# Altium schematic sheet JETSON_PWR_MUX.SchDoc
size B; SheetNumber: 18; SheetTotal: 19
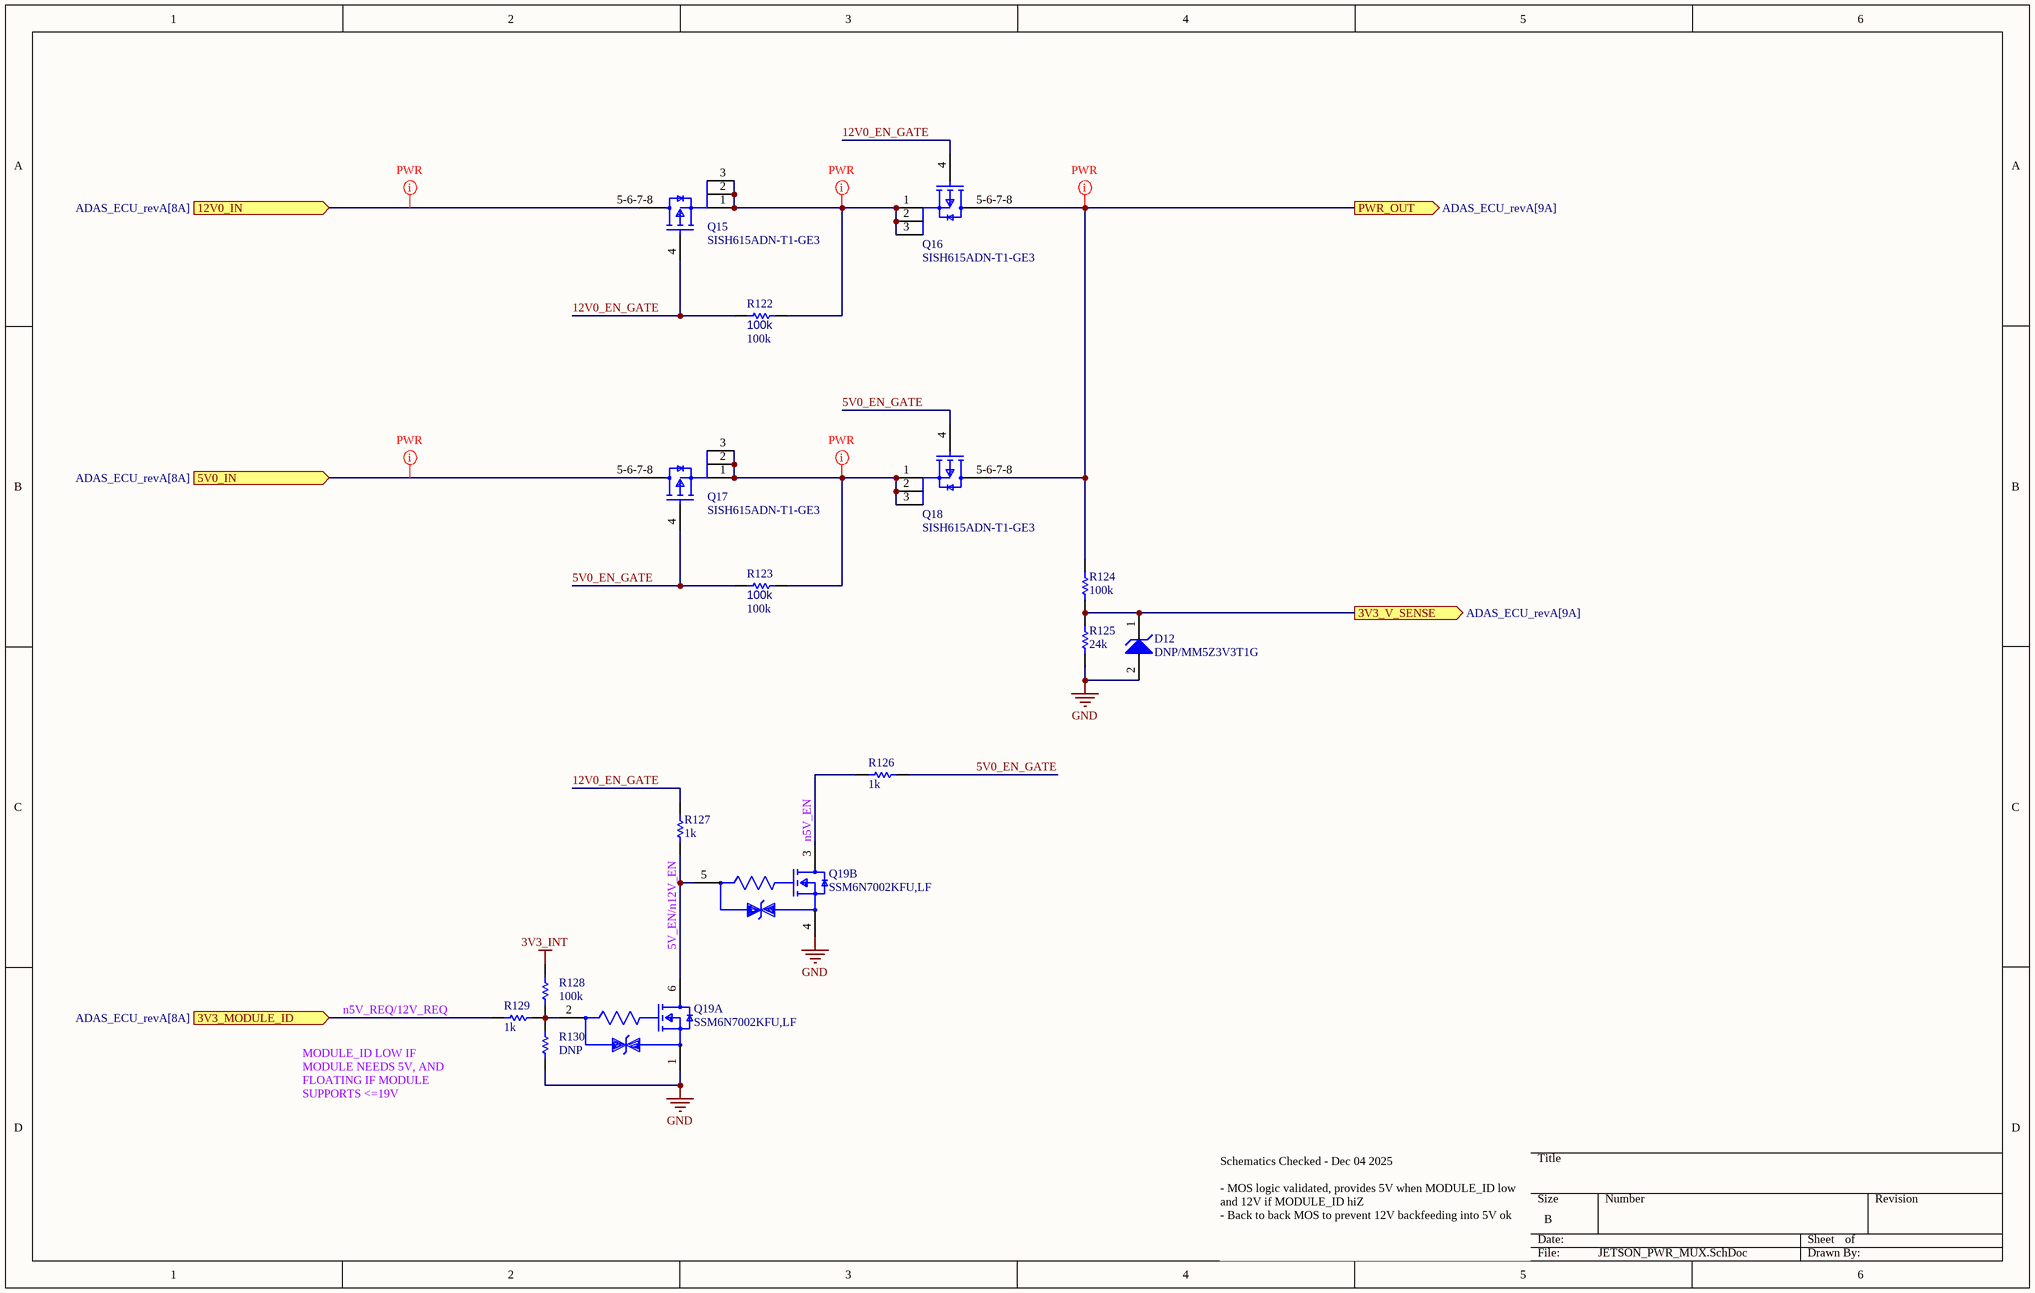
[diagram p0: JETSON_PWR_MUX.SchDoc]

## Parts
D12  DNP/MM5Z3V3T1G  [ONSC-SOD-523-2-502-01_V]
Q15  SISH615ADN-T1-GE3  [SISH615ADN-T1-GE3-Footprint-1]
Q16  SISH615ADN-T1-GE3  [SISH615ADN-T1-GE3-Footprint-1]
Q17  SISH615ADN-T1-GE3  [SISH615ADN-T1-GE3-Footprint-1]
Q18  SISH615ADN-T1-GE3  [SISH615ADN-T1-GE3-Footprint-1]
Q19  SSM6N7002KFU,LF  [FP-SSOP6-P-0_65A-MFG]  (parts A,B of 2)
R122  100k  [R0603B]
R123  100k  [R0603B]
R124  100k  [R0603B]
R125  24k  [R0603B]
R126  1k  [R0603B]
R127  1k  [R0603B]
R128  100k  [R0603B]
R129  1k  [R0603B]
R130  DNP  [R0603B]

## Ports
3V3_MODULE_ID (in, see ADAS_ECU_revA[8A]), 3V3_V_SENSE (out, see ADAS_ECU_revA[9A]), 5V0_IN (in, see ADAS_ECU_revA[8A]), 12V0_IN (in, see ADAS_ECU_revA[8A]), PWR_OUT (out, see ADAS_ECU_revA[9A])

## Nets
3V3_INT: R128.1
GND: D12.2(A) Q19.1(Source1) Q19.4(Source2) R125.1 R130.2
3V3_MODULE_ID: R129.1 ; port 3V3_MODULE_ID
3V3_V_SENSE: D12.1(K) R124.1 R125.2 ; port 3V3_V_SENSE
5V0_EN_GATE: Q17.4(G) Q18.4(G) R123.2 R126.2
5V0_IN: Q17.5-6-7-8(D) ; port 5V0_IN
12V0_EN_GATE: Q15.4(G) Q16.4(G) R122.2 R127.2
12V0_IN: Q15.5-6-7-8(D) ; port 12V0_IN
PWR_OUT: Q16.5-6-7-8(D) Q18.5-6-7-8(D) R124.2 ; port PWR_OUT
NetQ15_1: Q15.1(S) Q15.2(S) Q15.3(S) Q16.1(S) Q16.2(S) Q16.3(S) R122.1
NetQ17_1: Q17.1(S) Q17.2(S) Q17.3(S) Q18.1(S) Q18.2(S) Q18.3(S) R123.1
NetQ19_2: Q19.2(Gate1) R128.2 R129.2 R130.1
NetQ19_3: Q19.3(Drain2) R126.1
NetQ19_5: Q19.5(Gate2) Q19.6(Drain1) R127.1

## Layout directives
net class PWR: 5V0_IN, 12V0_IN, NetQ15_1, NetQ17_1, PWR_OUT

## Notes on the sheet
- (near Q19) n5V_EN
- 5V_EN/n12V_EN
- n5V_REQ/12V_REQ
- MODULE_ID LOW IF MODULE NEEDS 5V, AND FLOATING IF MODULE SUPPORTS <=19V
- Schematics Checked - Dec 04 2025
  - MOS logic validated, provides 5V when MODULE_ID low and 12V if MODULE_ID hiZ
  - Back to back MOS to prevent 12V backfeeding into 5V ok

## Library data of the parts
D12 = CMP-1060-00750-1: Zener Voltage Regulator, 500 mW, 2-Pin SOD-523, Pb-Free, Tape and Reel; Manufacturer: On Semiconductor; P Max (W): 0.5; VZ Typ (V): 3.3; RoHS: Pb-Free; ComponentLink2Description: Datasheet; PackageReference: SOD-523-2-502-01; DatasheetVersion: Rev. 10; ComponentLink1Description: Manufacturer URL; PackageVersion: Rev. E, 09/2010; ComponentLink3URL: http://www.onsemi.com/pub_link/Collateral/502-01.PDF; ComponentLink2URL: http://www.onsemi.cn/pub_link/Collateral/MM5Z2V4T1-D.PDF; Mounting Technology: Surface Mount; PartNumber: MM5Z3V3T1G; Packing: Tape and Reel; PackageDescription: 2-Pin SOD, Body 1.2 x 0.8 mm; ComponentLink1URL: http://www.onsemi.com/; ComponentLink3Description: Package Specification
Q15-Q18 = CMP-013-00018-2: Trans MOSFET P-CH 20V 22.1A 8-Pin PowerPAK 1212 EP T/R; Source: SISH615ADN-T1-GE3.SchLib; Design Item ID: CMP-013-00036-4; Component Type: Standard; Pins: 5
Q19 = CMP-35916-000009-1: MOSFET 2N-CH 60V 0.3A; Input Capacitance: 40pF; Continuous Drain Current (ID): 300mA; Max Power Dissipation: 285mW; FET Type: 2 N-Channel; Rds On Max: 1.5R; Mount: Surface Mount; Drain to Source Voltage (Vdss): 60V; Packaging: Tape and Reel
R122-R130 = CMP-009-00002-14: Resistor
  R122-R124: Value: 100k
  R125: Value: 24k
  R130: Value: DNP